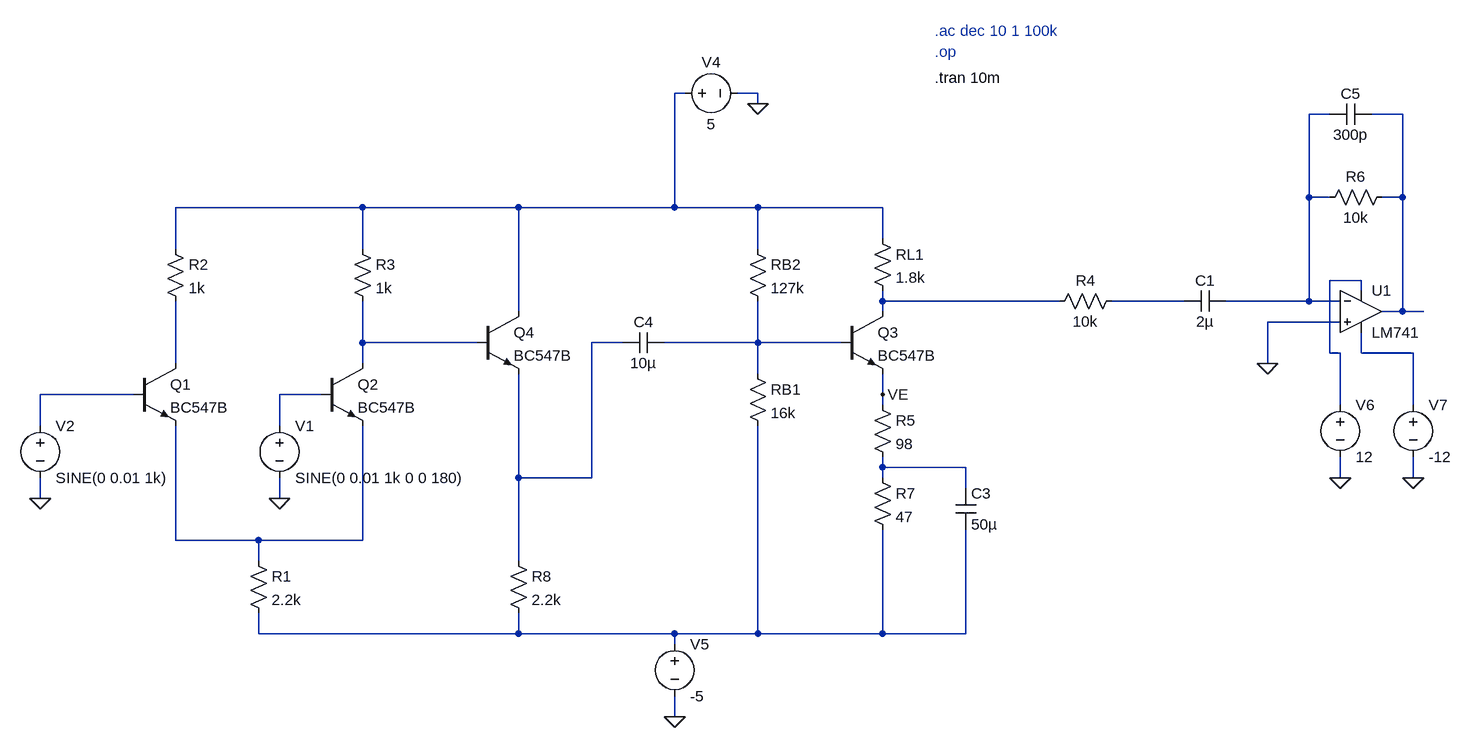
[diagram p0: schematic preamp-gain-filter.asc]
preamp-gain-filter.asc, the LTspice schematic file:
Version 4
SHEET 1 2456 872
WIRE 880 -112 864 -112
WIRE 992 -112 960 -112
WIRE 992 -96 992 -112
WIRE 1872 -80 1840 -80
WIRE 1984 -80 1936 -80
WIRE 1840 48 1840 -80
WIRE 1872 48 1840 48
WIRE 1984 48 1984 -80
WIRE 1984 48 1952 48
WIRE 384 64 96 64
WIRE 624 64 384 64
WIRE 864 64 864 -112
WIRE 864 64 624 64
WIRE 992 64 864 64
WIRE 1184 64 992 64
WIRE 1184 112 1184 64
WIRE 96 128 96 64
WIRE 384 128 384 64
WIRE 992 128 992 64
WIRE 1920 176 1872 176
WIRE 1920 192 1920 176
WIRE 1184 208 1184 192
WIRE 1456 208 1184 208
WIRE 1648 208 1536 208
WIRE 1840 208 1840 48
WIRE 1840 208 1712 208
WIRE 1888 208 1840 208
WIRE 624 224 624 64
WIRE 1184 224 1184 208
WIRE 1984 224 1984 48
WIRE 1984 224 1952 224
WIRE 2016 224 1984 224
WIRE 1888 240 1776 240
WIRE 384 272 384 208
WIRE 560 272 384 272
WIRE 784 272 736 272
WIRE 992 272 992 208
WIRE 992 272 848 272
WIRE 1120 272 992 272
WIRE 1872 288 1872 176
WIRE 1888 288 1872 288
WIRE 1920 288 1920 256
WIRE 2000 288 1920 288
WIRE 96 304 96 208
WIRE 384 304 384 272
WIRE 1776 304 1776 240
WIRE 992 320 992 272
WIRE 32 352 -112 352
WIRE 320 352 256 352
WIRE 1184 352 1184 320
WIRE 1184 368 1184 352
WIRE 1888 368 1888 288
WIRE 2000 368 2000 288
WIRE -112 400 -112 352
WIRE 256 400 256 352
WIRE 1184 464 1184 448
WIRE 1312 464 1184 464
WIRE 624 480 624 320
WIRE 736 480 736 272
WIRE 736 480 624 480
WIRE 1184 480 1184 464
WIRE 1888 480 1888 448
WIRE 2000 480 2000 448
WIRE 1312 496 1312 464
WIRE -112 512 -112 480
WIRE 256 512 256 480
WIRE 96 576 96 400
WIRE 224 576 96 576
WIRE 384 576 384 400
WIRE 384 576 224 576
WIRE 224 608 224 576
WIRE 624 608 624 480
WIRE 224 720 224 688
WIRE 624 720 624 688
WIRE 624 720 224 720
WIRE 864 720 624 720
WIRE 992 720 992 400
WIRE 992 720 864 720
WIRE 1184 720 1184 560
WIRE 1184 720 992 720
WIRE 1312 720 1312 560
WIRE 1312 720 1184 720
WIRE 864 736 864 720
WIRE 864 848 864 816
FLAG 992 -96 0
FLAG 864 848 0
FLAG -112 512 0
FLAG 1184 352 VE
FLAG 256 512 0
FLAG 1776 304 0
FLAG 1888 480 0
FLAG 2000 480 0
DATAFLAG 1184 208 ""
DATAFLAG 928 272 ""
SYMBOL res 976 304 R0
SYMATTR InstName RB1
SYMATTR Value 16k
SYMBOL res 976 112 R0
SYMATTR InstName RB2
SYMATTR Value 127k
SYMBOL npn 1120 224 R0
SYMATTR InstName Q3
SYMATTR Value BC547B
SYMBOL res 1168 96 R0
SYMATTR InstName RL1
SYMATTR Value 1.8k
SYMBOL voltage 864 -112 R270
WINDOW 0 32 56 VTop 2
WINDOW 3 -32 56 VBottom 2
WINDOW 123 0 0 Left 0
WINDOW 39 0 0 Left 0
SYMATTR InstName V4
SYMATTR Value 5
SYMBOL Res 1168 352 R0
SYMATTR InstName R5
SYMATTR Value 98
SYMBOL Res 1168 464 R0
SYMATTR InstName R7
SYMATTR Value 47
SYMBOL Cap 1296 496 R0
SYMATTR InstName C3
SYMATTR Value 50µ
SYMBOL Voltage 864 720 R0
SYMATTR InstName V5
SYMATTR Value -5
SYMBOL npn 32 304 R0
SYMATTR InstName Q1
SYMATTR Value BC547B
SYMBOL npn 320 304 R0
SYMATTR InstName Q2
SYMATTR Value BC547B
SYMBOL Res 208 592 R0
SYMATTR InstName R1
SYMATTR Value 2.2k
SYMBOL Voltage -112 384 R0
SYMATTR InstName V2
SYMATTR Value SINE(0 0.01 1k)
SYMBOL Res 80 112 R0
SYMATTR InstName R2
SYMATTR Value 1k
SYMBOL Res 368 112 R0
SYMATTR InstName R3
SYMATTR Value 1k
SYMBOL Cap 848 256 R90
WINDOW 0 0 32 VBottom 2
WINDOW 3 32 32 VTop 2
SYMATTR InstName C4
SYMATTR Value 10µ
SYMBOL Voltage 256 384 R0
SYMATTR InstName V1
SYMATTR Value SINE(0 0.01 1k 0 0 180)
SYMBOL Cap 1712 192 R90
WINDOW 0 0 32 VBottom 2
WINDOW 3 32 32 VTop 2
SYMATTR InstName C1
SYMATTR Value 2µ
SYMBOL LM741 1920 160 R0
SYMATTR InstName U1
SYMBOL Res 1968 32 R90
WINDOW 0 0 56 VBottom 2
WINDOW 3 32 56 VTop 2
SYMATTR InstName R6
SYMATTR Value 10k
SYMBOL Cap 1936 -96 R90
WINDOW 0 0 32 VBottom 2
WINDOW 3 32 32 VTop 2
SYMATTR InstName C5
SYMATTR Value 300p
SYMBOL Voltage 1888 352 R0
SYMATTR InstName V6
SYMATTR Value 12
SYMBOL Voltage 2000 352 R0
SYMATTR InstName V7
SYMATTR Value -12
SYMBOL npn 560 224 R0
SYMATTR InstName Q4
SYMATTR Value BC547B
SYMBOL Res 608 592 R0
SYMATTR InstName R8
SYMATTR Value 2.2k
SYMBOL Res 1552 192 R90
WINDOW 0 0 56 VBottom 2
WINDOW 3 32 56 VTop 2
SYMATTR InstName R4
SYMATTR Value 10k
TEXT 1264 -136 Left 2 !.tran 10m
TEXT 1264 -176 Left 2 ;.op
TEXT 1264 -208 Left 2 ;.ac dec 10 1 100k

The netlist it stands for:
* preamp-gain-filter.asc
RB1 N009 N016 16k
RB2 N001 N009 127k
Q3 N005 N009 VE 0 BC547B
RL1 N001 N005 1.8k
V4 N001 0 5
R5 VE N014 98
R7 N014 N016 47
C3 N014 N016 50µ
V5 N016 0 -5
Q1 N011 N012 N015 0 BC547B
Q2 N007 N013 N015 0 BC547B
R1 N015 N016 2.2k
V2 N012 0 SINE(0 0.01 1k)
R2 N001 N011 1k
R3 N001 N007 1k
C4 N009 N008 10µ
V1 N013 0 SINE(0 0.01 1k 0 0 180)
C1 N002 N006 2µ
XU1 0 N002 N004 N010 N003 LM741  ; pins In+ In- V+ V- OUT
R6 N003 N002 10k
C5 N003 N002 300p
V6 N004 0 12
V7 N010 0 -12
Q4 N001 N007 N008 0 BC547B
R8 N008 N016 2.2k
R4 N006 N005 10k
.model NPN NPN
.model PNP PNP
.lib standard.bjt
.tran 10m
* .op
* .ac dec 10 1 100k
.lib LM741.lib
.backanno
.end